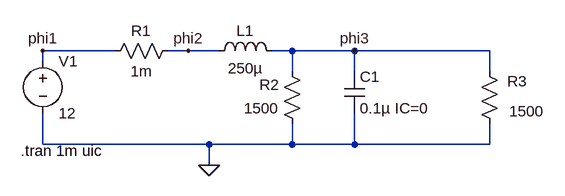
[diagram p0: schematic koaxialKabel1.asc]
koaxialKabel1.asc, the LTspice schematic file:
Version 4
SHEET 1 880 680
WIRE 128 96 16 96
WIRE 240 96 208 96
WIRE 288 96 240 96
WIRE 400 96 368 96
WIRE 496 96 400 96
WIRE 704 96 496 96
WIRE 16 112 16 96
WIRE 400 128 400 96
WIRE 496 128 496 96
WIRE 704 128 704 96
WIRE 16 240 16 192
WIRE 272 240 16 240
WIRE 400 240 400 208
WIRE 400 240 272 240
WIRE 496 240 496 192
WIRE 496 240 400 240
WIRE 704 240 704 208
WIRE 704 240 496 240
WIRE 272 272 272 240
FLAG 272 272 0
FLAG 16 96 phi1
FLAG 240 96 phi2
FLAG 496 96 phi3
SYMBOL res 112 112 R270
WINDOW 0 31 55 VTop 2
WINDOW 3 0 56 VBottom 2
SYMATTR InstName R1
SYMATTR Value 1m
SYMBOL ind 272 112 R270
WINDOW 0 31 56 VTop 2
WINDOW 3 5 56 VBottom 2
SYMATTR InstName L1
SYMATTR Value 250µ
SYMBOL res 416 224 R180
WINDOW 0 36 76 Left 2
WINDOW 3 36 40 Left 2
SYMATTR InstName R2
SYMATTR Value 1500
SYMBOL res 720 224 R180
WINDOW 0 -42 81 Left 2
WINDOW 3 -68 35 Left 2
SYMATTR InstName R3
SYMATTR Value 1500
SYMBOL cap 480 128 R0
SYMATTR InstName C1
SYMATTR Value 0.1µ IC=0
SYMBOL voltage 16 96 R0
WINDOW 123 0 0 Left 0
WINDOW 39 0 0 Left 0
SYMATTR InstName V1
SYMATTR Value 12
TEXT -18 250 Left 2 !.tran 1m uic

The netlist it stands for:
* koaxialKabel1.asc
R1 phi1 phi2 1m
L1 phi2 phi3 250µ
R2 0 phi3 1500
R3 0 phi3 1500
C1 phi3 0 0.1µ IC=0
V1 phi1 0 12
.tran 1m uic
.backanno
.end